# Altium schematic sheet MB1272-Project.SchDoc: MB1272
size A4; Date: Not used; ApprovedBy: Not used; CheckedBy: Not used; Author: Not used; CompanyName: STMicroelectronics; DrawnBy: Not used; Engineer: Not used; Organization: Not used; Address1: Not used; Address2: Not used; Address3: Not used; Address4: Not used; DocumentNumber: Not used; Revision: Not used; SheetNumber: 1; SheetTotal: 15; CurrentTime: Not used; CurrentDate: Not used; Time: Not used; DocumentFullPathAndName: Not used; DocumentName: Not used; ModifiedDate: Not used; ImagePath: Not used; ProjectName: STM32MP15x-DISCO-PI; Application_BuildNumber: Not used
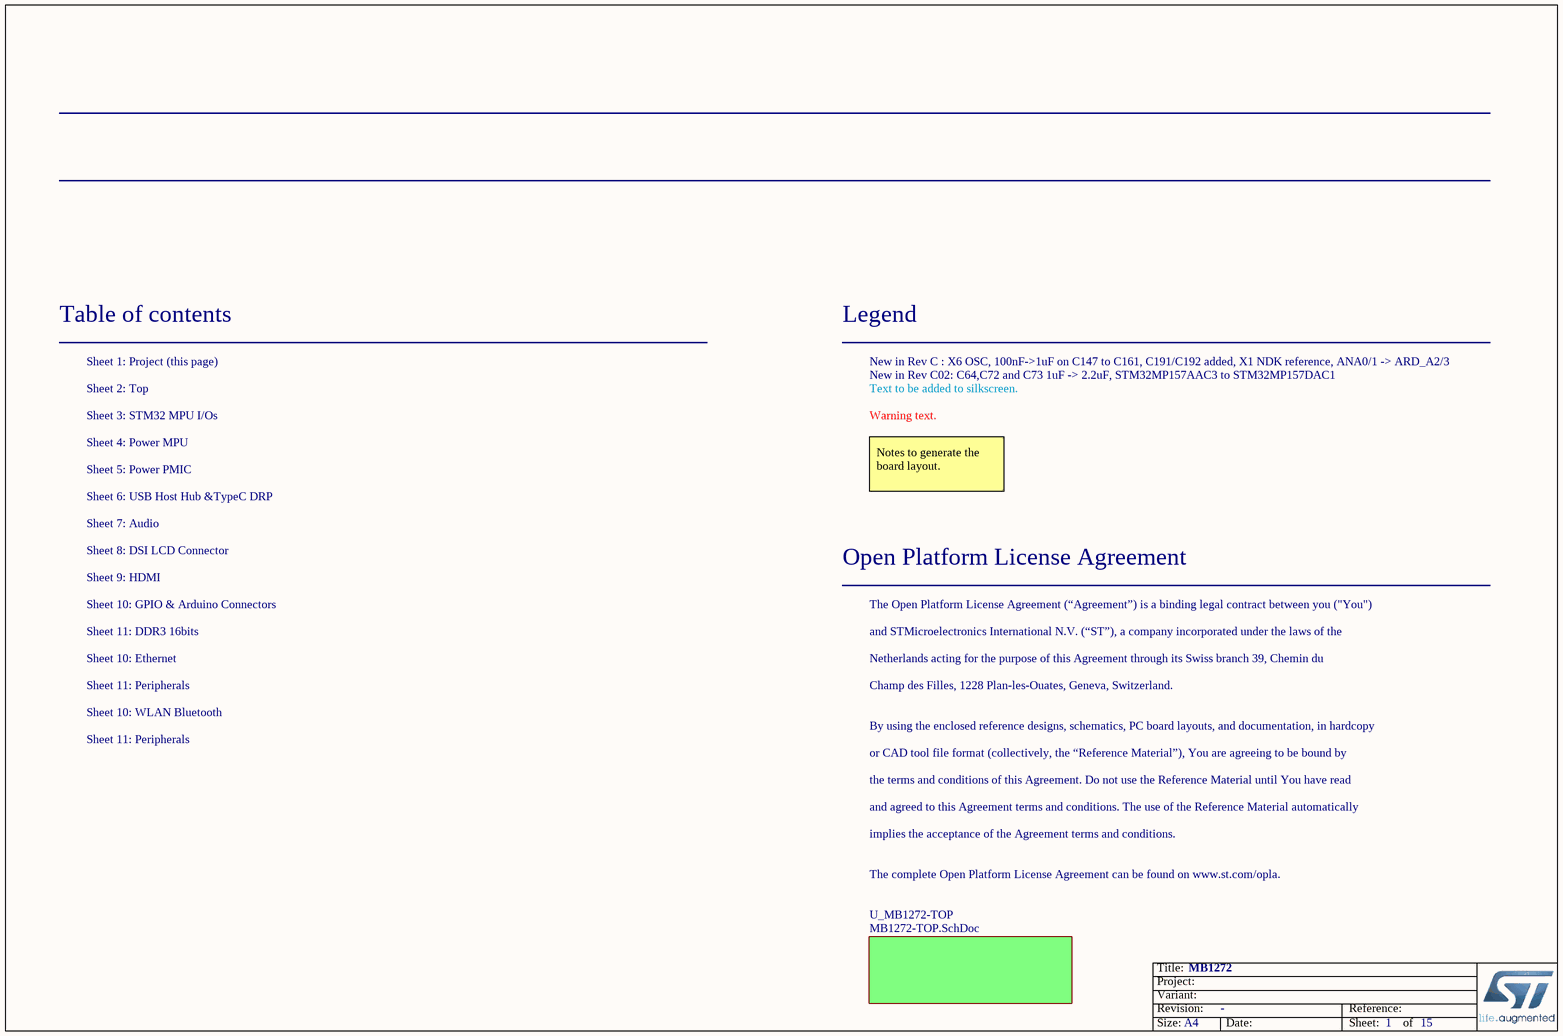
[diagram p0: MB1272-Project.SchDoc]

## Sub-sheets
U_MB1272-TOP = MB1272-TOP.SchDoc: no entries

## Notes on the sheet
- Table of contents
- Sheet 1: Project (this page)
- Legend
- New in Rev C : X6 OSC, 100nF->1uF on C147 to C161, C191/C192 added, X1 NDK reference, ANA0/1 -> ARD_A2/3
- New in Rev C02: C64,C72 and C73 1uF -> 2.2uF, STM32MP157AAC3 to STM32MP157DAC1
- Sheet 2: Top
- Sheet 3: STM32 MPU I/Os
- Sheet 4: Power MPU
- Text to be added to silkscreen.
- Warning text.
- Sheet 6: USB Host Hub &TypeC DRP
- Sheet 5: Power PMIC
- Notes to generate the board layout.
- Sheet 7: Audio
- Sheet 9: HDMI
- Sheet 8: DSI LCD Connector
- Open Platform License Agreement
- Sheet 10: GPIO & Arduino Connectors
- Sheet 11: DDR3 16bits
- The Open Platform License Agreement (“Agreement”) is a binding legal contract between you ("You")
- and STMicroelectronics International N.V. (“ST”), a company incorporated under the laws of the
- Sheet 10: Ethernet
- Sheet 11: Peripherals
- Sheet 10: WLAN Bluetooth
- Netherlands acting for the purpose of this Agreement through its Swiss branch 39, Chemin du
- Champ des Filles, 1228 Plan-les-Ouates, Geneva, Switzerland.
- By using the enclosed reference designs, schematics, PC board layouts, and documentation, in hardcopy
- or CAD tool file format (collectively, the “Reference Material”), You are agreeing to be bound by
- the terms and conditions of this Agreement. Do not use the Reference Material until You have read
- and agreed to this Agreement terms and conditions. The use of the Reference Material automatically
- implies the acceptance of the Agreement terms and conditions.
- The complete Open Platform License Agreement can be found on www.st.com/opla.
- Title:
- Project:
- Size:
- Revision:
- Variant:
- A4
- -
- Date:
- Reference:
- Sheet:
- of